# EAGLE design Motor Driver L298 (EAGLE 5.04)
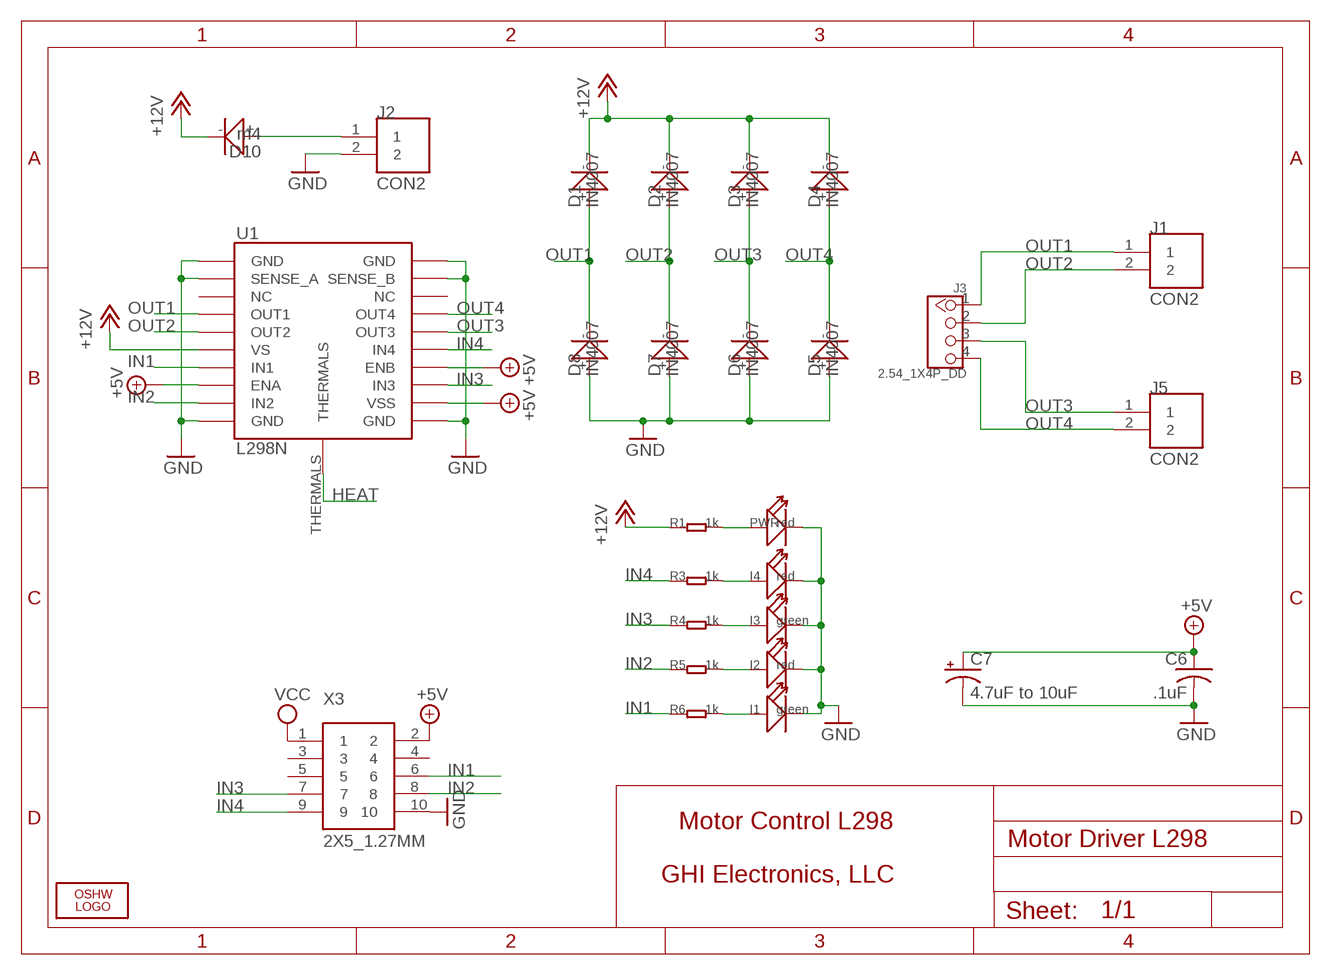
[diagram p0: schematic, sheet 1]

## Parts
C6  .1uF  C-USC0603K  [C0603K]
C7  4.7uF to 10uF  CPOL-USCT3528  [CT3528]
D1  IN4007  010-D2010  [D2010]
D2  IN4007  010-D2010  [D2010]
D3  IN4007  010-D2010  [D2010]
D4  IN4007  010-D2010  [D2010]
D5  IN4007  010-D2010  [D2010]
D6  IN4007  010-D2010  [D2010]
D7  IN4007  010-D2010  [D2010]
D8  IN4007  010-D2010  [D2010]
D10  m4  010-D2010  [D2010]
I1  green  007-LED0603  [D0603]
I2  red  007-LED0603  [D0603]
I3  green  007-LED0603  [D0603]
I4  red  007-LED0603  [D0603]
J1  CON2  [CON2]
J2  CON2  [CON2]
J3  2.54_1X4P_DD  [CK_1X4]
J5  CON2  [CON2]
LOGO2  LOGO-OSHW-FILLX0200-NT  [OSHW_FILLX200_NOTEXT]
PWR  red  007-LED0603  [D0603]
R1  1k  005-R0603  [0603-1]
R3  1k  005-R0603  [0603-1]
R4  1k  005-R0603  [0603-1]
R5  1k  005-R0603  [0603-1]
R6  1k  005-R0603  [0603-1]
U1  L298N  L298_BRIDGE_DRIVER  [POWERSO20]
X3  2X5_1.27MM  [2X5_1.27MM]

## Nets
+5V [power]: C6.1 C7.+ U1.P$8(ENA) U1.P$12(VSS) U1.P$14(ENB) X3.2
+12V: D1.- D2.- D3.- D4.- D10.- R1.1 U1.P$6(VS)
GND: C6.2 C7.- D5.+ D6.+ D7.+ D8.+ I1.- I2.- I3.- I4.- J2.2 PWR.- U1.P$1(GND) U1.P$2(SENSE_A) U1.P$10(GND) U1.P$11(GND) U1.P$19(SENSE_B) U1.P$20(GND) X3.10
HEAT: U1.THERMALS
IN1: R6.1 U1.P$7(IN1) X3.6
IN2: R5.1 U1.P$9(IN2) X3.8
IN3: R4.1 U1.P$13(IN3) X3.7
IN4: R3.1 U1.P$15(IN4) X3.9
N$1: I2.+ R5.2
N$2: PWR.+ R1.2
N$6: D10.+ J2.1
N$14: I4.+ R3.2
N$15: I3.+ R4.2
N$17: I1.+ R6.2
OUT1: D1.+ D8.- J1.1 J3.1 U1.P$4(OUT1)
OUT2: D2.+ D7.- J1.2 J3.2 U1.P$5(OUT2)
OUT3: D3.+ D6.- J3.3 J5.1 U1.P$16(OUT3)
OUT4: D4.+ D5.- J3.4 J5.2 U1.P$17(OUT4)
VCC: X3.1
Unconnected: U1.P$3(NC) U1.P$18(NC) X3.3 X3.4 X3.5

## Notes on the sheet
- Motor Control L298
- GHI Electronics, LLC

## Library data of the parts
C6 = rcl:C-US: CAPACITOR, American symbol
C7 = rcl:CPOL-US: POLARIZED CAPACITOR, American symbol
D1-D8 D10 = Discrete:010-D*
I1-I4 PWR = Discrete:007-LED*
J1 J2 J5 = 2pin:CON2
J3 = Connector:2.54_1X4P
LOGO2 = Logo:LOGO-OSHW-FILL
R1 R3-R6 = Discrete:005-R*
U1 = ICs:L298_BRIDGE_DRIVER
X3 = GHI:2X5_1.27MM

## Board
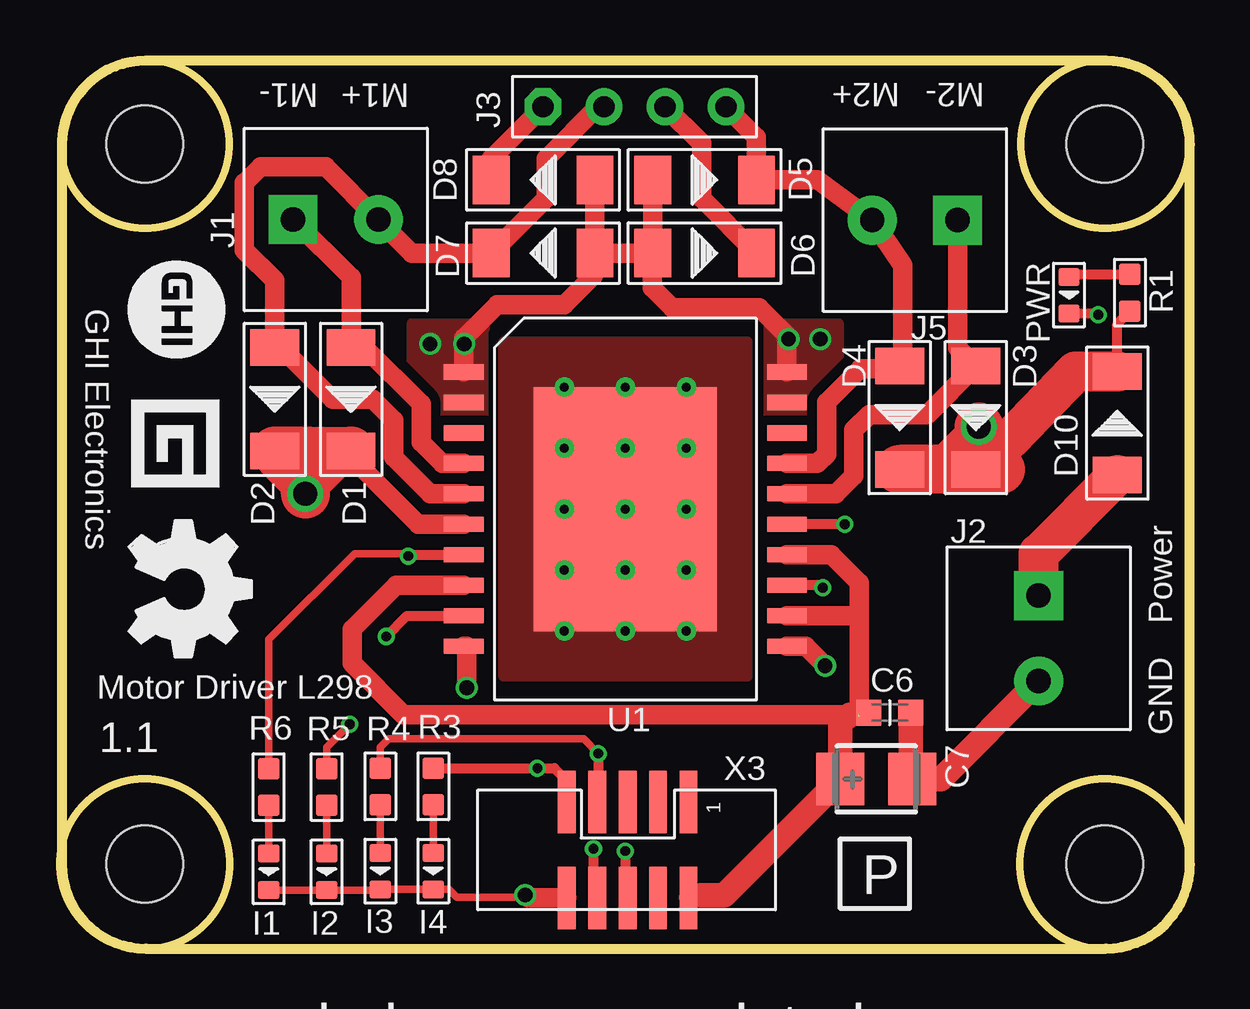
[diagram p1: board, top side]
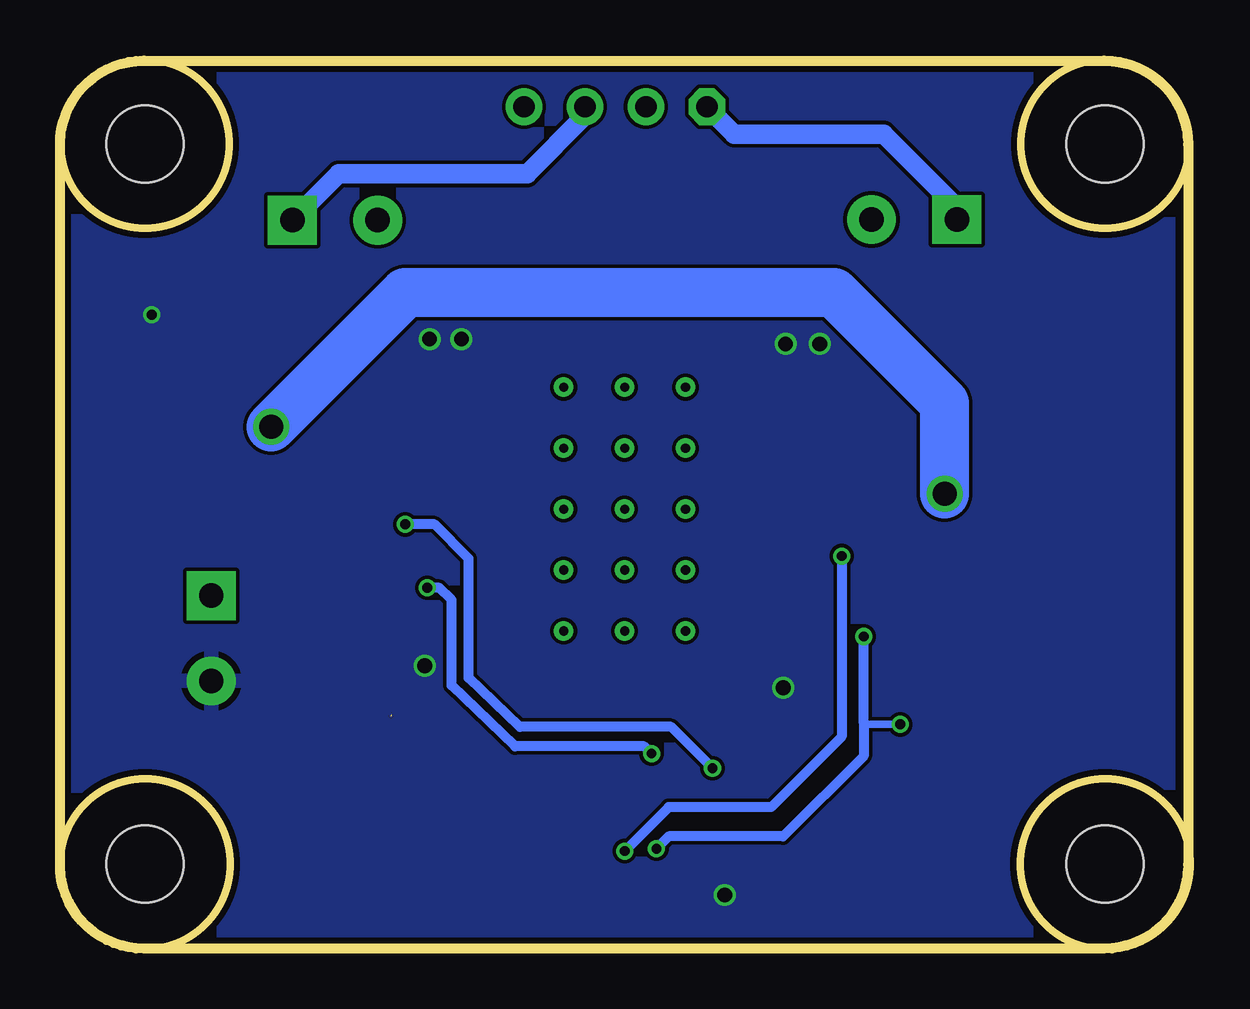
[diagram p2: board, bottom side, seen from below]

Size 47.08 x 37.04 mm. Coordinates in mm from the lower left corner, seen from the top.
Outline: 43.58,0.01 arc90 47.08,3.51 47.08,33.51 arc90 43.58,37.01 3.58,37.01 arc90 0.08,33.51 0.08,3.51 arc90 3.58,0.01 43.58,0.01
Outline: circle at 3.54,33.54 radius 3.5
Outline: circle at 43.54,33.54 radius 3.5
Outline: circle at 43.54,3.54 radius 3.54
Outline: circle at 3.54,3.54 radius 3.54
Copper layers (1*16): Top 0.035mm / dielectric 1.5mm / Bottom 0.035mm
Design rules "SeeedStudio_rule_no_angle_090911": minimum track width 6mil, minimum drill 12mil, track to track 6mil, track to pad 6mil, pad to pad 6mil, via to via 6mil, smd to smd 0mil, copper to edge 10mil, drill to drill 10mil, minimum pad ring 10mil, minimum via ring 6mil, stop-mask expansion 2mil, vias tented up to drill 100mil, thermal gap 10mil
Holes 3.2 mm at 3.54,3.54 43.54,33.54 3.54,33.54 43.54,3.54

### Footprints (pad centres in the part's own frame; a part is rotated, then mirrored left to right if it is on the bottom)
C0603K = smd 1.05 x 1.08: 1 -0.875,0; 2 0.875,0
CT3528 = smd 2 x 2.2: + 1.5,0; - -1.5,0
D2010 = smd 1.524 x 2.032: + -2.159,0; - 2.159,0
D0603 = smd 0.762 x 0.889: + -0.762,0; - 0.762,0
CON2 = drill 1.016 pad 2.032 square: 1 0,1.778 | drill 1.016 pad 2.032 round: 2 0,-1.778
CK_1X4 = drill 0.889 pad 1.524 octagon: 1 0,3.81 | drill 0.889 pad 1.524 round: 2 0,1.27; 3 0,-1.27; 4 0,-3.81
0603-1 = smd 0.889 x 0.889: 1 -0.762,0; 2 0.762,0
POWERSO20 = smd 1.651 x 0.635: P$1 -6.731,5.715; P$2 -6.731,4.445; P$3 -6.731,3.175; P$4 -6.731,1.905; P$5 -6.731,0.635; P$6 -6.731,-0.635; P$7 -6.731,-1.905; P$8 -6.731,-3.175; P$9 -6.731,-4.445; P$10 -6.731,-5.715; P$11 6.731,-5.715; P$12 6.731,-4.445; P$13 6.731,-3.175; P$14 6.731,-1.905; P$15 6.731,-0.635; P$16 6.731,0.635; P$17 6.731,1.905; P$18 6.731,3.175; P$19 6.731,4.445; P$20 6.731,5.715 | smd 7.62 x 10.16: THERMALS 0,0
2X5_1.27MM = smd 2.6 x 0.74: 1 -2,2.58; 2 2,2.58; 3 -2,1.31; 4 2,1.31; 5 -2,0.04; 6 2,0.04; 7 -2,-1.23; 8 2,-1.23; 9 -2,-2.5; 10 2,-2.5

### Placement (x,y rotation side)
C6  34.57,9.84 0 top
C7  34.01,7.08 180 top
D1  12.13,22.9 270 top
D2  8.95,22.9 270 top
D3  38.16,22.13 270 top
D4  34.99,22.13 270 top
D5  26.86,32.04 0 top
D6  26.86,28.99 0 top
D7  20.13,28.99 180 top
D8  20.13,32.04 180 top
D10  44.05,21.9 90 top
I1  8.7,3.21 270 top
I2  11.11,3.21 270 top
I3  13.35,3.24 270 top
I4  15.55,3.24 270 top
J1  11.49,30.39 90 top
J2  40.78,12.94 0 top
J3  23.94,35.09 90 top
J5  35.62,30.36 270 top
LOGO2  2.9,17.83 270 top
PWR  42.04,27.24 270 top
R1  44.58,27.34 90 top
R3  15.55,6.77 270 top
R4  13.35,6.77 270 top
R5  11.11,6.74 270 top
R6  8.7,6.74 270 top
U1  23.56,18.32 0 top
X3  23.61,4.12 270 top

### Tracks (layer width: path | path; a pad name or v marks a point on that pad's centre or on a via)
+5V  (1 unrouted)
  Top 0.406: X3.2 26.58,2.12 26.7,2.24
  Top 0.813: U1.P$14 32.13,16.42 33.3,15.25 33.3,13.62 | 33.3,13.62 33.3,9.97 33.3,9.7 | U1.P$12 33.05,13.88 33.3,13.62 | X3.2 26.19,2.14 | U1.P$8 14,15.15 12.17,13.32 12.17,11.9 14.3,9.76 32.9,9.76 33.27,9.76
  Top 1.016: 26.7,2.24 27.68,2.24 C7.+ 32.51,9.38 32.9,9.76 | C6.1 33.42,9.84 33.3,9.97
+12V  (via drill 1 pad 1.27)
  Top 0.406: D10.- 44.05,26.05 R1.1
  Top 0.813: D1.- 12.51,20.36 12.51,20.1 14.92,17.69 U1.P$6
  Top 1.676: D10.- 42.32,24.06 39.6,21.24 38.8,21.24 v38.29,21.75
  Top 2.032: D3.- D4.- | D3.- 39.19,19.97 | 38.29,21.24 38.29,20.1 D3.- | 10.35,20.74 D2.- | 10.35,20.74 D1.- | 10.35,20.74 10.22,20.61 v10.22,18.96 10.22,19.47 | 38.29,21.24 v38.29,21.75 38.29,20.86 | 38.29,21.24 37.14,20.1 | 10.22,19.47 11.36,20.61 | 10.22,19.47 9.2,20.48
  Bottom 2.032: v10.22,18.96 10.22,22.74 14.82,27.34 32.7,27.34 v38.29,21.75
GND  (via drill 0.41, 0.61)
  Top 0.305: I1.- I2.- 13.32,2.45 I3.- I4.- 16.21,2.47 16.54,2.14 19.28,2.14 v19.38,2.24
  Top 0.406: PWR.- 43.11,26.48 v43.26,26.42
  Top 0.813: U1.P$20 30.29,25.56 29.14,26.71 25.5,26.71 24.67,27.54 24.67,28.96 D6.+ | U1.P$1 16.82,25.44 18.22,26.83 21.01,26.83 22.23,28.05 22.23,28.93 D7.+ | D6.+ D5.+ | D7.+ D6.+ | D7.+ D8.+ | X3.10 19.5,2.12 v19.38,2.24 | U1.P$10 16.95,12.61 v16.95,10.88 | U1.P$11 31.07,12.61 v31.88,11.79
  Top 1.016: J2.2 36.69,7.08 C7.- 35.45,7.14 C6.2
  other vias: 15.42,25.21 16.84,25.21 31.68,25.41 30.36,25.41
  pour Top (isolate 0.406, rank 2, no thermals): 31.68,25.31 31.68,22.13 29.52,22.13 29.52,25.31
  pour Top (isolate 0.406, rank 2, no thermals): 17.71,26.07 17.71,22.13 14.67,22.13 14.67,26.07
  pour Top (isolate 0.406, rank 2, no thermals): 32.45,26.07 32.45,22.13 29.52,22.13 29.52,26.07
  pour Bottom (rank 6): 0.89,36.89 0.89,-0.09 47.02,-0.09 47.02,36.89
  pour Bottom (isolate 0.406, no thermals): 29.02,25.31 29.14,10.32 17.08,10.32 17.08,25.31
HEAT  (via drill 0.38 pad 0.81)
  other vias: 23.56,18.32 23.56,15.78 23.56,20.86 26.1,15.78 26.1,18.32 26.1,20.86 21.02,20.86 21.02,18.32 21.02,15.78 26.1,13.24 23.56,13.24 21.02,13.24 21.02,23.4 23.56,23.4 26.1,23.4
  pour Top (isolate 0.406, no thermals): 28.64,25.31 28.64,11.34 18.48,11.34 18.48,25.31
IN1  (via drill 0.41)
  Top 0.305: R6.1 8.7,12.89 12.27,16.47 14.41,16.47 v14.51,16.37
  Top 0.406: U1.P$7 14.66,16.42 v14.51,16.37 | X3.6 23.55,2.23 v23.55,4.07
  Bottom 0.406: v14.51,16.37 14.51,8.85 17.45,5.9 21.72,5.9 v23.55,4.07
IN2  (via drill 0.41)
  Top 0.305: R5.1 11.11,8.4 v12.07,9.36
  Top 0.406: U1.P$9 14.46,13.88 v13.59,13.01 | v22.23,4.17 22.23,2.28 X3.8
  Bottom 0.305: v12.07,9.36 13.49,9.36 13.59,9.46
  Bottom 0.406: v13.59,13.01 13.59,9.46 13.59,8.03 16.95,4.68 21.72,4.68 v22.23,4.17
IN3  (via drill 0.41)
  Top 0.305: R4.1 13.34,8.4 13.69,8.75 21.82,8.75 v22.43,8.14
  Top 0.406: U1.P$13 31.68,15.15 v31.78,15.05 | v22.43,8.14 22.43,6.18 X3.7
  Bottom 0.406: v31.78,15.05 31.27,15.05 30.76,14.54 30.76,10.98 28.12,8.44 22.74,8.44 v22.43,8.14
IN4  (via drill 0.41)
  Top 0.305: 21.21,5.19 21.21,6.02 X3.9
  Top 0.406: U1.P$15 v32.69,17.69 | X3.9 21.21,6.23 21.21,6.92 20.6,7.53 v19.89,7.53 R3.1
  Bottom 0.406: v32.69,17.69 31.47,17.69 30.05,16.26 30.05,11.29 27.92,9.25 21.62,9.25 v19.89,7.53
N$1
  Top 0.305: I2.+ R5.2
N$2
  Top 0.406: R1.2 42.14,28.1 PWR.+
N$6
  Top 1.676: J2.1 40.78,16.47 D10.+
N$14
  Top 0.305: I4.+ R3.2
N$15
  Top 0.305: I3.+ R4.2
N$17
  Top 0.305: I1.+ R6.2
OUT1
  Top 0.813: U1.P$4 15.94,20.23 15.05,21.12 15.05,22.71 12.7,25.05 D1.+ 12.13,27.98 J1.1 | D8.- 17.97,32.93 J3.1
  Bottom 0.813: J1.1 9.71,30.9 12.76,33.94 18.98,33.94 J3.1
OUT2
  Top 0.813: U1.P$5 15.43,18.96 13.9,20.48 13.9,22.03 13.04,22.9 11.36,22.9 9.46,24.8 9.2,24.8 D2.+ 8.95,27.85 7.68,29.12 7.68,31.92 7.7,31.92 8.37,32.58 11.08,32.58 J1.2 14.67,28.99 D7.- 20.25,31.28 20.25,32.93 22.41,35.09 J3.2
OUT3
  Top 0.813: U1.P$16 32.32,18.96 33.08,19.72 33.08,21.63 33.72,22.26 36.13,22.26 D3.+ 37.4,25.05 J5.1 | D6.- 26.73,31.28 26.73,33.56 J3.3
  Bottom 0.813: 37.4,29.88 J5.1 35.47,32.29 27.62,32.29 25.21,34.71 J3.3
OUT4
  Top 0.813: U1.P$17 31.56,20.23 31.94,20.61 31.94,22.77 33.33,24.17 34.86,24.17 D4.+ 35.11,24.42 35.11,28.48 J5.2 31.56,32.04 D5.- 29.02,33.82 J3.4

### Text on the board
tPlace: M1- | M1+ | M2+ | M2- | GHI Electronics | Power | Motor Driver L298 | GND | 1.1 | P | corner holes are non-plated | Black PCB with white print | Do not add any manufacturing Code!
bPlace: No text on back side